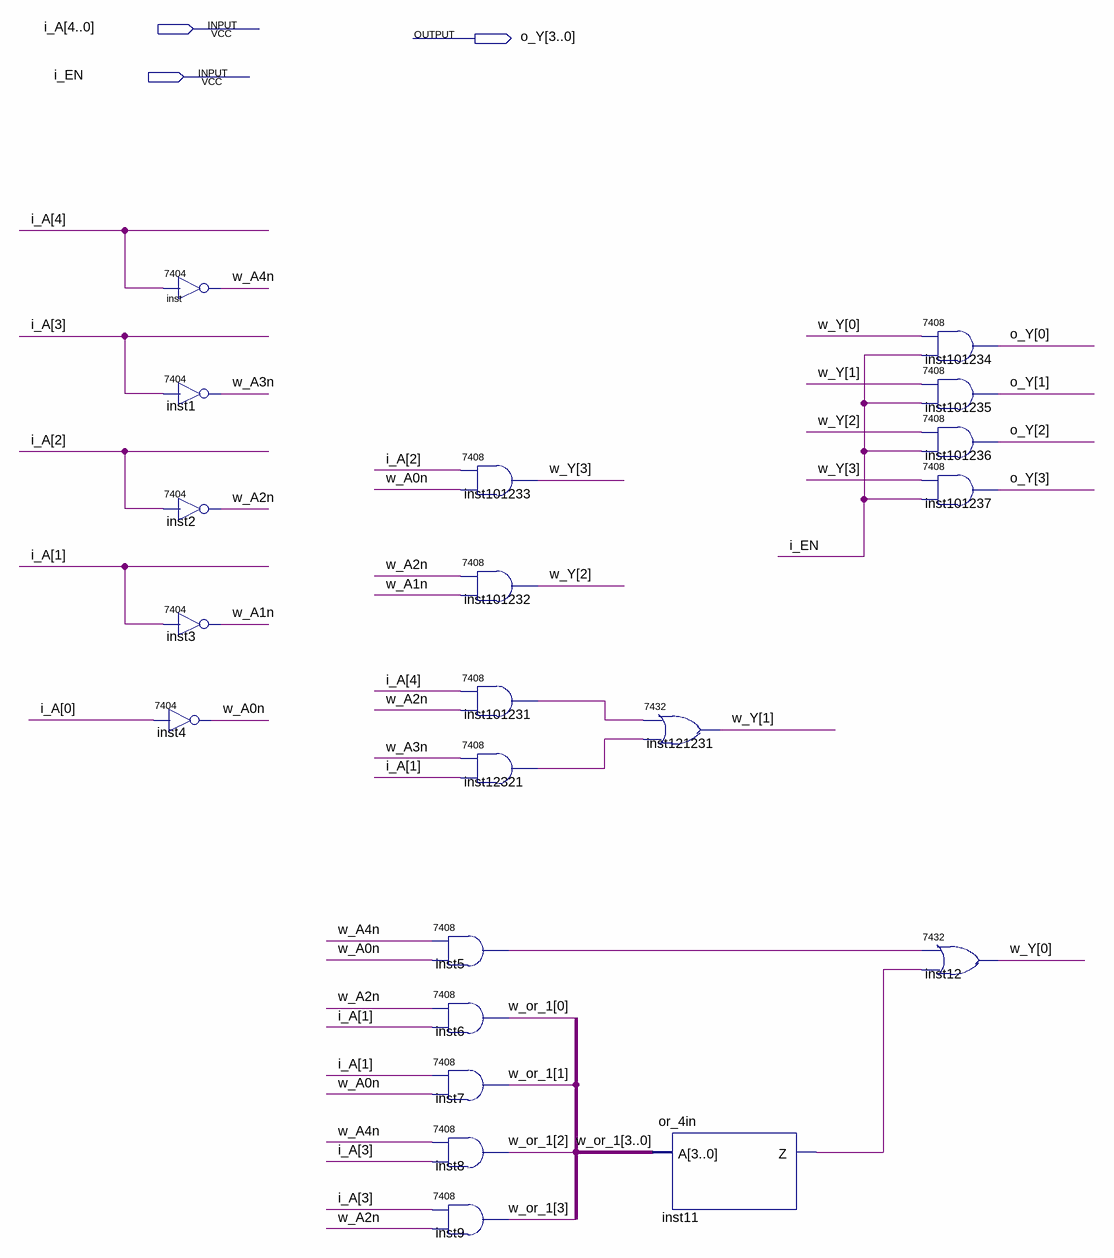
[diagram p0: schematic sheet]
// Quartus schematic morse_decoder_5_by_4_en.bdf as structural Verilog: 21 symbols, 3 pins
module morse_decoder_5_by_4_en (
  input  [4:0] i_A,
  input  i_EN,
  output [3:0] o_Y
);

  wire inst5_1, inst11_z, inst12321_1, inst101231_1, w_A0n, w_A1n, w_A2n, w_A3n, w_A4n;
  wire [3:0] w_or_1, w_Y;

  \7404  inst (.\2 (i_A[4]), .\1 (w_A4n));
  \7404  inst1 (.\2 (i_A[3]), .\1 (w_A3n));
  \7404  inst2 (.\2 (i_A[2]), .\1 (w_A2n));
  \7404  inst3 (.\2 (i_A[1]), .\1 (w_A1n));
  \7404  inst4 (.\2 (i_A[0]), .\1 (w_A0n));
  \7408  inst5 (.\3 (w_A0n), .\2 (w_A4n), .\1 (inst5_1));
  \7408  inst6 (.\3 (i_A[1]), .\2 (w_A2n), .\1 (w_or_1[0]));
  \7408  inst7 (.\3 (w_A0n), .\2 (i_A[1]), .\1 (w_or_1[1]));
  \7408  inst8 (.\3 (i_A[3]), .\2 (w_A4n), .\1 (w_or_1[2]));
  \7408  inst9 (.\3 (w_A2n), .\2 (i_A[3]), .\1 (w_or_1[3]));
  \7408  inst101233 (.\3 (w_A0n), .\2 (i_A[2]), .\1 (w_Y[3]));
  \7408  inst101232 (.\3 (w_A1n), .\2 (w_A2n), .\1 (w_Y[2]));
  \7408  inst101231 (.\3 (w_A2n), .\2 (i_A[4]), .\1 (inst101231_1));
  \7408  inst12321 (.\3 (i_A[1]), .\2 (w_A3n), .\1 (inst12321_1));
  \7432  inst121231 (.\2 (inst101231_1), .\3 (inst12321_1), .\1 (w_Y[1]));
  or_4in inst11 (.A(w_or_1), .Z(inst11_z));
  \7408  inst101234 (.\3 (i_EN), .\2 (w_Y[0]), .\1 (o_Y[0]));
  \7408  inst101235 (.\3 (i_EN), .\2 (w_Y[1]), .\1 (o_Y[1]));
  \7408  inst101236 (.\3 (i_EN), .\2 (w_Y[2]), .\1 (o_Y[2]));
  \7408  inst101237 (.\3 (i_EN), .\2 (w_Y[3]), .\1 (o_Y[3]));
  \7432  inst12 (.\2 (inst5_1), .\3 (inst11_z), .\1 (w_Y[0]));
endmodule
